# Altium schematic sheet USB.SchDoc
size A4
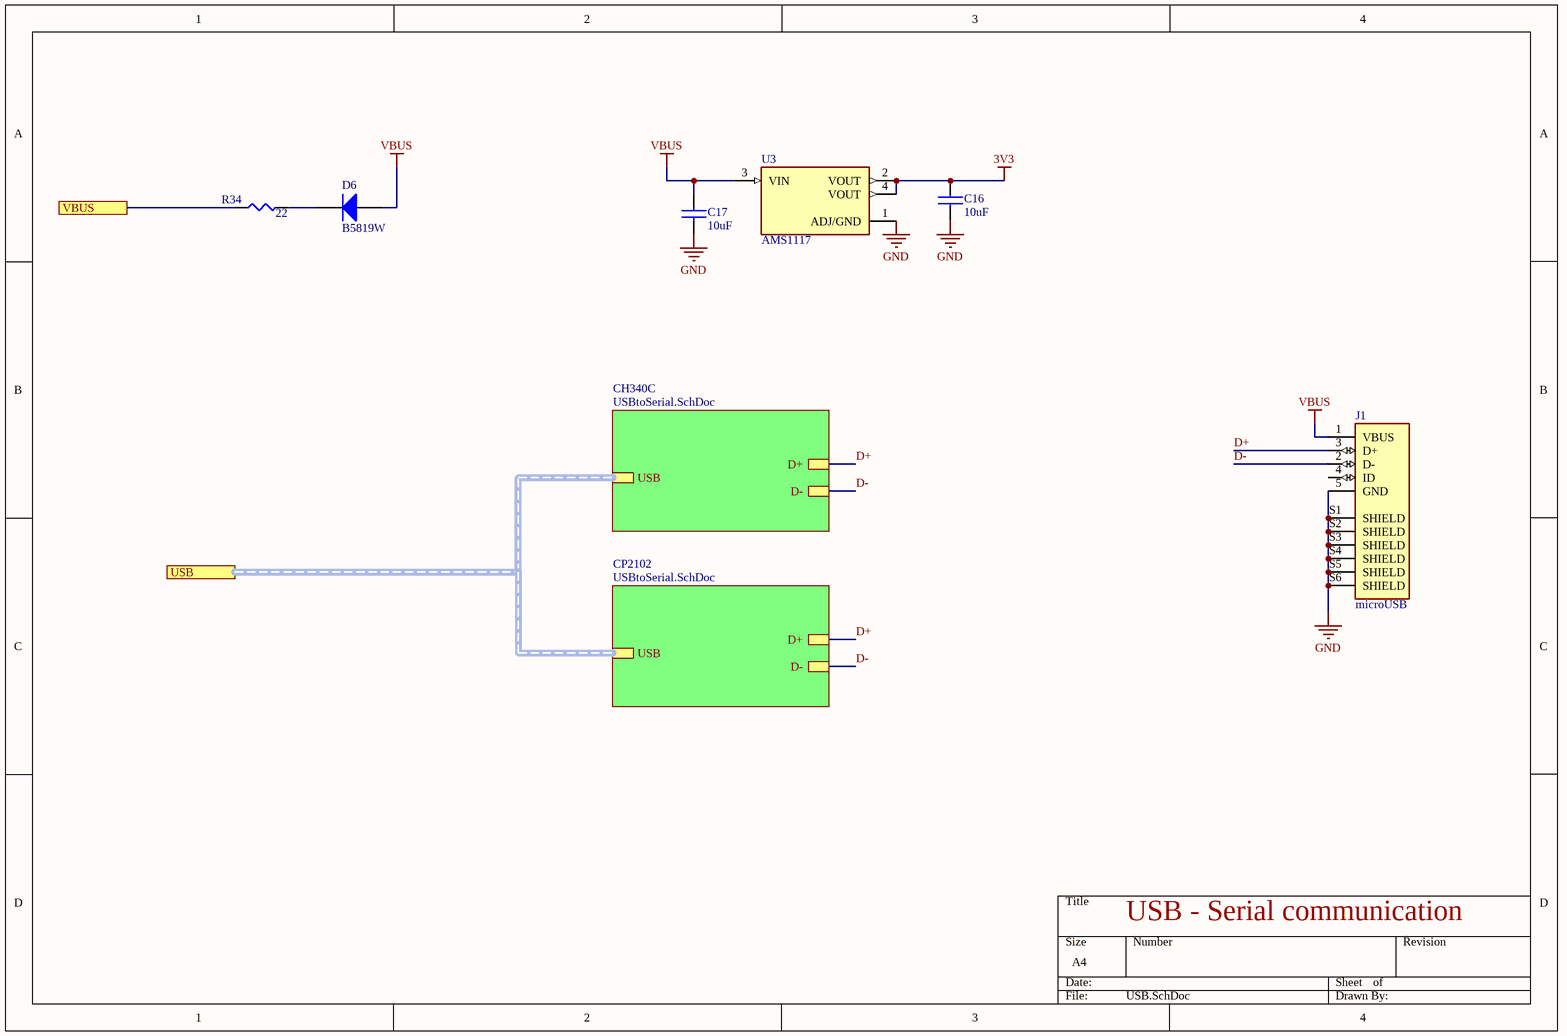
[diagram p0: USB.SchDoc]

## Parts
C16  10uF  [CAPC160X80X90L35N]
C17  10uF  [CAPC160X80X90L35N]
D6  B5819W  [SODFL350X110-2N]
J1  microUSB  [SHOUHAN_MICROXNJ]
R34  22  [RESC160X80X90L30N]
U3  AMS1117  [SOT229P700X180-4N]

## Sub-sheets
CH340C = USBtoSerial.SchDoc: D+, D-, USB
CP2102 = USBtoSerial.SchDoc: D+, D-, USB

## Ports
USB (harness USB), VBUS

## Nets
3V3: C16.1 U3.2(VOUT) U3.4(VOUT)
GND: C16.2 C17.2 J1.5(GND) J1.S1(SHIELD) J1.S2(SHIELD) J1.S3(SHIELD) J1.S4(SHIELD) J1.S5(SHIELD) J1.S6(SHIELD) U3.1(ADJ/GND)
VBUS: C17.1 D6.A J1.1(VBUS) U3.3(VIN)
D+: J1.3(D+) ; sheet CH340C/D+, sheet CP2102/D+
D-: J1.2(D-) ; sheet CH340C/D-, sheet CP2102/D-
VBUS: R34.1 ; port VBUS  [a separate net that carries the same name]
NetD6_C: D6.C R34.2

Not connected (* = marked no-connect by the designer): J1 4(ID)

## Buses and harness runs
harness port USB = sheet CH340C/USB = sheet CP2102/USB

## Notes on the sheet
- USB - Serial communication

## Library data of the parts
C16 C17 = Capacitor: Part: USB; Value: 10uF; Part Number: *; LCSC Part #: C19702; Package: *
D6 = Diode: Part: USB; Part Number: B5819W; LCSC Part #: C8598
J1 = microUSB: Micro USB; MF: Shouhan; MP: MICROXNJ; Check_prices: https://www.snapeda.com/parts/MICROXNJ/Shouhan/view-part/5703693/?ref=eda; Price: None; SnapEDA_Link: https://www.snapeda.com/parts/MICROXNJ/Shouhan/view-part/5703693/?ref=snap; Availability: Unavailable; Package: Package; Value: *; LCSC Part #: C404969; Part: USB
R34 = Resistor: Part: USB; Value: 22; Part Number: *; LCSC Part #: C23345; Package: *
U3 = AMS1117: UNO PLUS Arduino R3 Shield, Xbee Arduino IDE Wheeled Robotics Kit; Part: USB; MF: Seeed Technology; Availability: Unavailable; SnapEDA_Link: https://www.snapeda.com/parts/AMS1117/Seeed%20Technology%20Co.%2C%20Ltd/view-part/184428/?ref=snap; MP: AMS1117; Price: None; Value: *; Package: SOT-223 Seeed Technology; LCSC Part #: C6186